# Altium schematic sheet Access_System_ADP.SchDoc
size A4; SheetNumber: 1; SheetTotal: 1
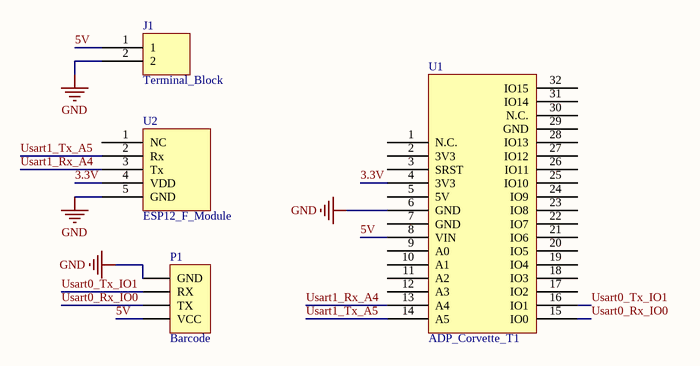
[diagram p0: Access_System_ADP.SchDoc]

## Parts
J1  Terminal_Block  [terminal block]
P1  Barcode  [HDR1X4]
U1  ADP_Corvette_T1  [Corvette_T1]
U2  ESP12_F_Module  [ESP12_F_Holtek]

## Nets
GND: J1.2 P1.1(GND) U1.6(GND) U2.5(GND)
3.3V: U1.4(3V3) U2.4(VDD)
5V: J1.1 P1.4(VCC) U1.8(VIN)
Usart0_Rx_IO0: P1.3(TX) U1.15(IO0)
Usart0_Tx_IO1: P1.2(RX) U1.16(IO1)
Usart1_Rx_A4: U1.13(A4) U2.3(Tx)
Usart1_Tx_A5: U1.14(A5) U2.2(Rx)

Not connected (* = marked no-connect by the designer): U1 1(N.C.) 2(3V3) 3(SRST) 5(5V) 7(GND) 9(A0) 10(A1) 11(A2) 12(A3) 17(IO2) 18(IO3) 19(IO4) 20(IO5) 21(IO6) 22(IO7) 23(IO8) 24(IO9) 25(IO10) 26(IO11) 27(IO12) 28(IO13) 29(GND) 30(N.C.) 31(IO14) 32(IO15); U2 1(NC)

## Library data of the parts
J1 = Terminal Block
P1 = Header 4: Header, 4-Pin; LatestRevisionDate: 17-Jul-2002; LatestRevisionNote: Re-released for DXP Platform.; Publisher: Altium Limited
U1 = Corvette_T1
U2 = ESP12_F_Holtek